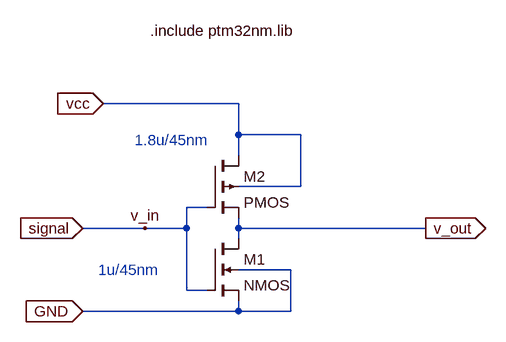
[diagram p0: schematic fast_inverterCKT.asc]
fast_inverterCKT.asc, the LTspice schematic file:
Version 4
SHEET 1 1464 680
WIRE 352 32 144 32
WIRE 352 80 352 32
WIRE 448 80 352 80
WIRE 352 112 352 80
WIRE 448 160 448 80
WIRE 448 160 352 160
WIRE 304 192 272 192
WIRE 208 224 112 224
WIRE 272 224 272 192
WIRE 272 224 208 224
WIRE 352 224 352 208
WIRE 640 224 352 224
WIRE 352 240 352 224
WIRE 432 288 352 288
WIRE 272 320 272 224
WIRE 304 320 272 320
WIRE 352 352 352 336
WIRE 352 352 112 352
WIRE 432 352 432 288
WIRE 432 352 352 352
FLAG 208 224 v_in
FLAG 144 32 vcc
IOPIN 144 32 In
FLAG 112 224 signal
IOPIN 112 224 In
FLAG 112 352 GND
IOPIN 112 352 In
FLAG 640 224 v_out
IOPIN 640 224 Out
SYMBOL nmos4 304 240 R0
SYMATTR InstName M1
SYMATTR Value2 l=45nm w=1u
SYMBOL pmos4 304 112 R0
SYMATTR InstName M2
SYMATTR Value2 l=45nm w=1.8u
TEXT 192 88 Left 2 ;1.8u/45nm
TEXT 136 288 Left 2 ;1u/45nm
TEXT 216 -80 Left 2 !.include ptm32nm.lib

The netlist it stands for:
* fast_inverterCKT.asc
M1 v_out signal GND GND NMOS l=45nm w=1u
M2 vcc signal v_out vcc PMOS l=45nm w=1.8u
.model NMOS NMOS
.model PMOS PMOS
.lib standard.mos
* 1.8u/45nm
* 1u/45nm
.include ptm32nm.lib
.backanno
.end